# Altium schematic sheet 2.0_LCD.SchDoc
size A4; DocumentNumber: 1; SheetNumber: 1; SheetTotal: 1
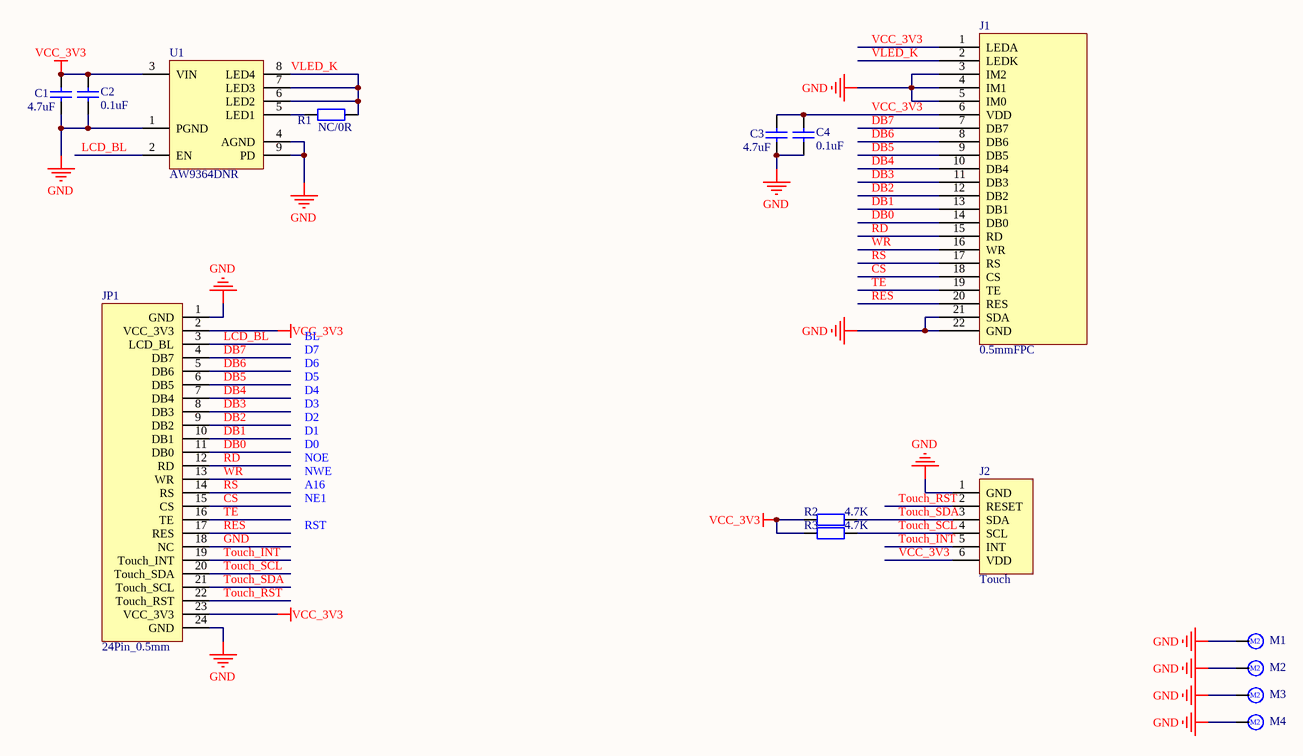
[diagram p0: 2.0_LCD.SchDoc]

## Parts
C1  4.7uF  [C0603_L]
C2  0.1uF  [C0402_L]
C3  4.7uF  [C0603_L]
C4  0.1uF  [C0402_L]
J1  0.5mmFPC  [FPC0.5-WT-22P]
J2  Touch  [FPC0.5-WT-6P]
JP1  24Pin_0.5mm  [FPC0.5-WT-24P]
M1  M2  [M2*4.5*2.5*0.8*3.3]  (value not drawn)
M2  M2  [M2*4.5*2.5*0.8*3.3]  (value not drawn)
M3  M2  [M2*4.5*2.5*0.8*3.3]  (value not drawn)
M4  M2  [M2*4.5*2.5*0.8*3.3]  (value not drawn)
R1  NC/0R  [R0402_L]
R2  4.7K  [R0402_L]
R3  4.7K  [R0402_L]
U1  AW9364DNR  [DFN2X2-8L]

## Nets
GND: C1.1 C2.1 C3.1 C4.1 J1.3(IM2) J1.4(IM1) J1.5(IM0) J1.21(SDA) J1.22(GND) J2.1(GND) JP1.1(GND) JP1.18(NC) JP1.24(GND) M1.1 M2.1 M3.1 M4.1 U1.1(PGND) U1.4(AGND) U1.9(PD)
VCC_3V3: C1.2 C2.2 C3.2 C4.2 J1.1(LEDA) J1.6(VDD) J2.6(VDD) JP1.2(VCC_3V3) JP1.23(VCC_3V3) R2.1 R3.1 U1.3(VIN)
CS: J1.18(CS) JP1.15(CS)
DB0: J1.14(DB0) JP1.11(DB0)
DB1: J1.13(DB1) JP1.10(DB1)
DB2: J1.12(DB2) JP1.9(DB2)
DB3: J1.11(DB3) JP1.8(DB3)
DB4: J1.10(DB4) JP1.7(DB4)
DB5: J1.9(DB5) JP1.6(DB5)
DB6: J1.8(DB6) JP1.5(DB6)
DB7: J1.7(DB7) JP1.4(DB7)
LCD_BL: JP1.3(LCD_BL) U1.2(EN)
RD: J1.15(RD) JP1.12(RD)
RES: J1.20(RES) JP1.17(RES)
RS: J1.17(RS) JP1.14(RS)
TE: J1.19(TE) JP1.16(TE)
Touch_INT: J2.5(INT) JP1.19(Touch_INT)
Touch_RST: J2.2(RESET) JP1.22(Touch_RST)
Touch_SCL: J2.4(SCL) JP1.20(Touch_SDA) R3.2
Touch_SDA: J2.3(SDA) JP1.21(Touch_SCL) R2.2
VLED_K: J1.2(LEDK) R1.1 U1.6(LED2) U1.7(LED3) U1.8(LED4)
WR: J1.16(WR) JP1.13(WR)
NetR1_2: R1.2 U1.5(LED1)

## Notes on the sheet
- D4
- D5
- D6
- D7
- BL
- D0
- D1
- D2
- D3
- NOE
- NWE
- NE1
- A16
- RST

## Library data of the parts
C1-C4 = C: 贴片电容; BOM名称: 无极性贴片电容; 联系卖家，免费查找封装: 唯一出售店铺网址https://shop463601444.taobao.com
J1 = 中景园2.0寸屏幕FPC接口
J2 = 深圳市大显伟业2.0寸触摸屏
JP1 = 屏幕板FPC: 屏幕板外接座
M1-M4 = M2系列: M2孔支撑柱
R1-R3 = R: 贴片电阻; 联系卖家，免费查找封装: 唯一出售店铺网址https://shop463601444.taobao.com; BOM名称: 贴片电阻
U1 = AW9364DNR: 并联调光背光驱动